# EAGLE design booz_imu (EAGLE 6.1)
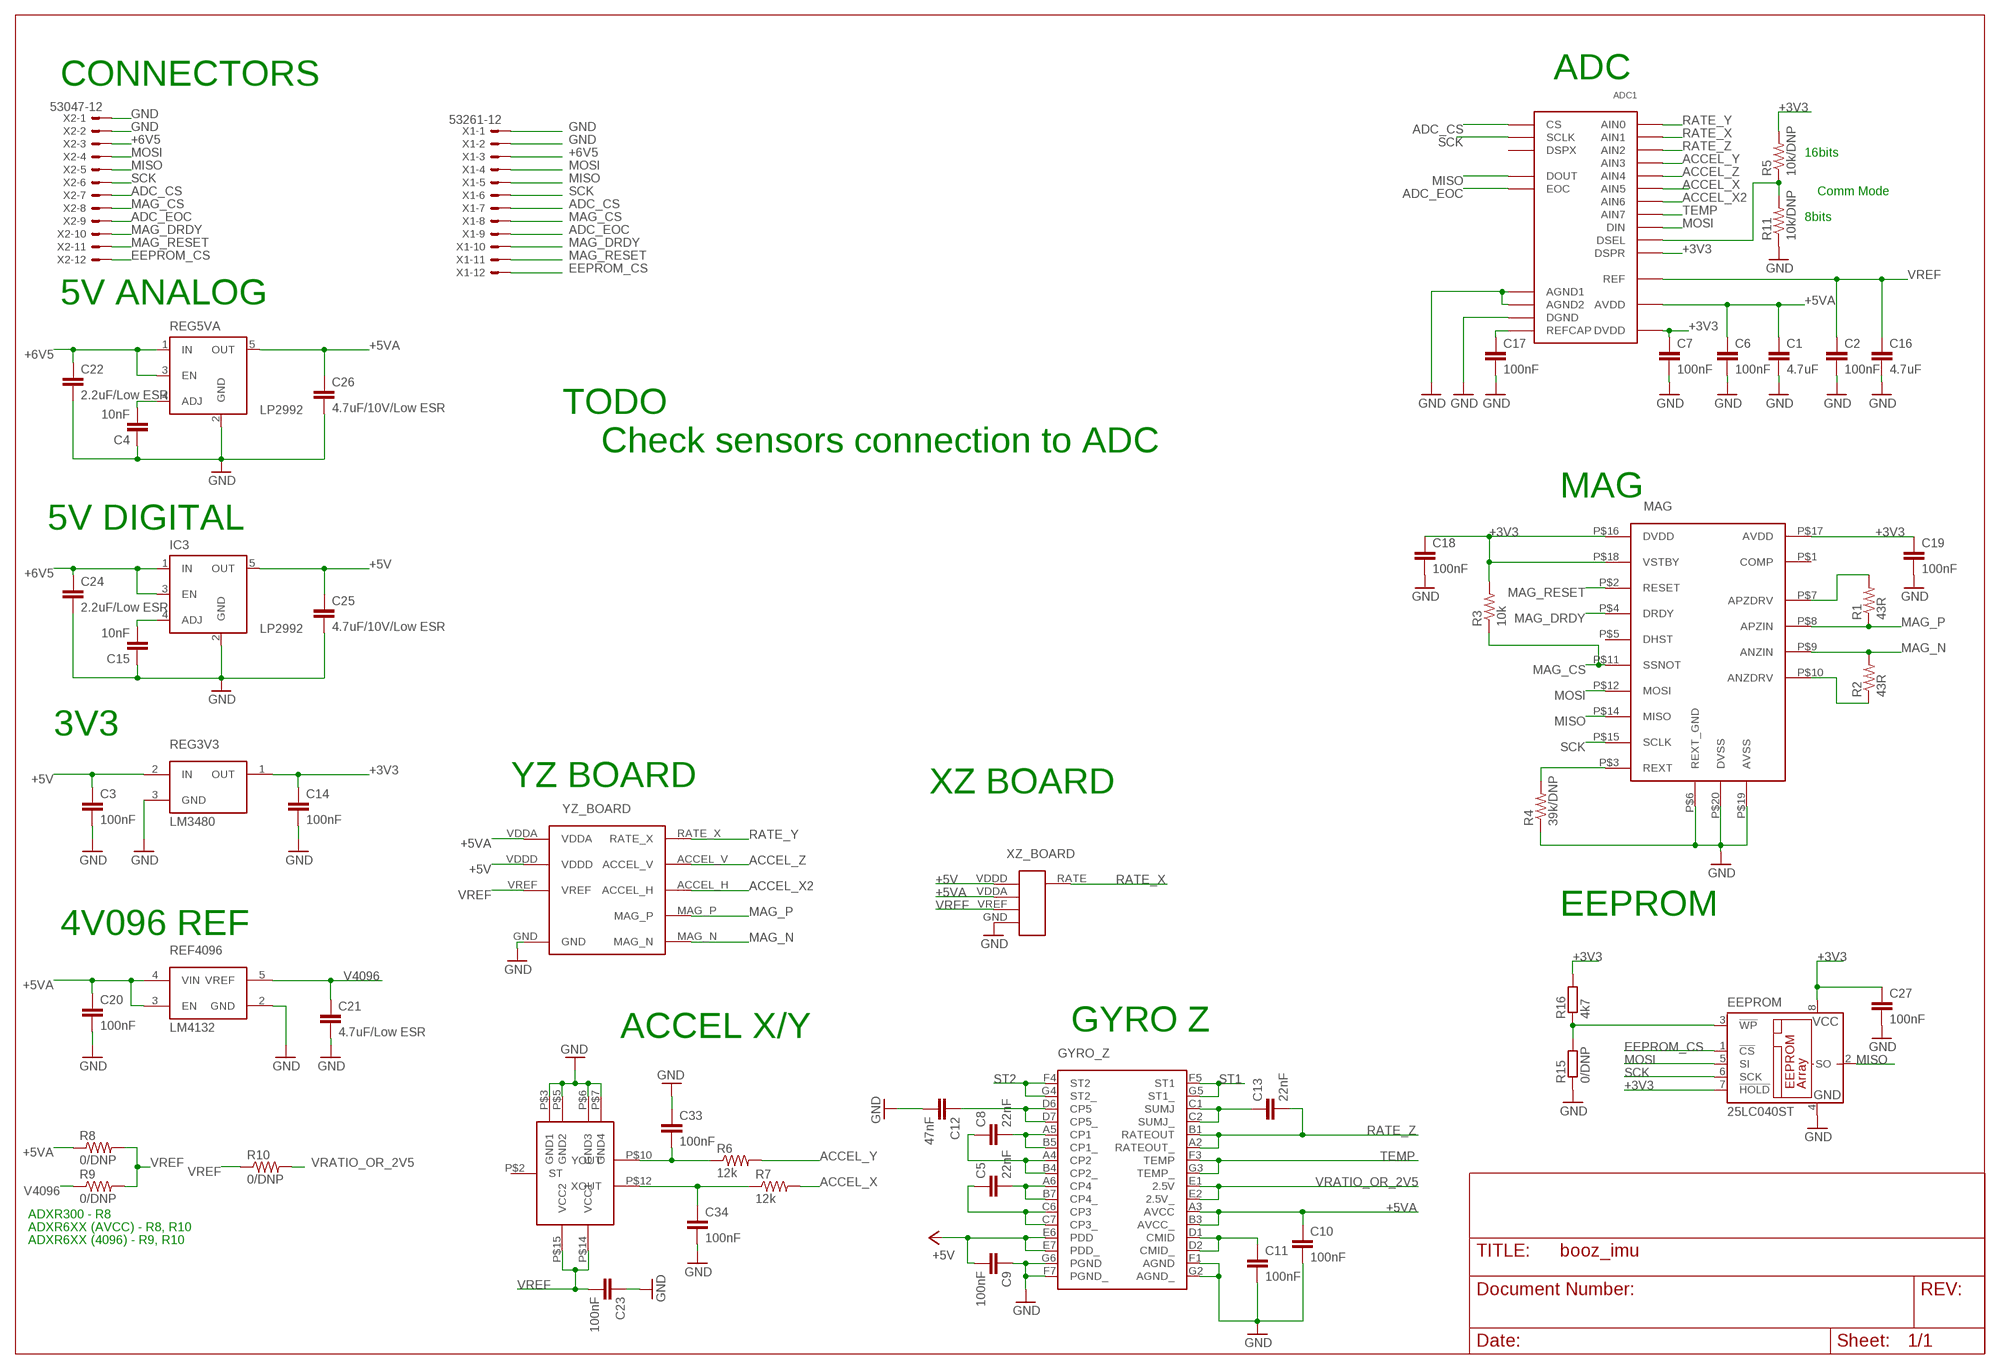
[diagram p0: schematic, sheet 1]

## Parts
ADC1  MAX1168  [QSOP24]
C1  4.7uF  C-EUC0805  [C0805]
C2  100nF  C-EUC0603K  [C0603K]
C3  100nF  C-EUC0603K  [C0603K]
C4  10nF  C-EUC0603K  [C0603K]
C5  22nF  C-EUC0603K  [C0603K]
C6  100nF  C-EUC0603K  [C0603K]
C7  100nF  C-EUC0603K  [C0603K]
C8  22nF  C-EUC0603K  [C0603K]
C9  100nF  C-EUC0603K  [C0603K]
C10  100nF  C-EUC0603K  [C0603K]
C11  100nF  C-EUC0603K  [C0603K]
C12  47nF  C-EUC0603K  [C0603K]
C13  22nF  C-EUC0603K  [C0603K]
C14  100nF  C-EUC0603K  [C0603K]
C15  10nF  C-EUC0603K  [C0603K]
C16  4.7uF  C-EUC0805  [C0805]
C17  100nF  C-EUC0603K  [C0603K]
C18  100nF  C-EUC0603K  [C0603K]
C19  100nF  C-EUC0603K  [C0603K]
C20  100nF  C-EUC0603K  [C0603K]
C21  4.7uF/Low ESR  C-EUC0805K  [C0805K]
C22  2.2uF/Low ESR  C-EUC0603K  [C0603K]
C23  100nF  C-EUC0603K  [C0603K]
C24  2.2uF/Low ESR  C-EUC0603K  [C0603K]
C25  4.7uF/10V/Low ESR  C-EUC0805K  [C0805K]
C26  4.7uF/10V/Low ESR  C-EUC0805K  [C0805K]
C27  100nF  C-EUC0603  [C0603]
C33  100nF  C-EUC0603K  [C0603K]
C34  100nF  C-EUC0603K  [C0603K]
EEPROM  25LC040ST  [TSSOP8]
GYRO_Z  ADXR  [BC-32]
IC3  LP2992  MIC5219BM5  [SOT23-5]
MAG  MS2100  [QFN20]
R1  43R  R-US_R0603  [R0603]
R2  43R  R-US_R0603  [R0603]
R3  10k  R-US_R0603  [R0603]
R4  39k/DNP  R-US_R0603  [R0603]
R5  10k/DNP  R-US_R0603  [R0603]
R6  12k  R-US_R0603  [R0603]
R7  12k  R-US_R0603  [R0603]
R8  0/DNP  R-US_R0603  [R0603]
R9  0/DNP  R-US_R0603  [R0603]
R10  0/DNP  R-US_R0603  [R0603]
R11  10k/DNP  R-US_R0603  [R0603]
R15  0/DNP  R-EU_R0603  [R0603]
R16  4k7  R-EU_R0603  [R0603]
REF4096  LM4132  [SOT23-5L]
REG3V3  LM3480  [SOT23]
REG5VA  LP2992  MIC5219BM5  [SOT23-5]
U$2  ADXL320  [LSCFP]
X1  53261-12  [53261-12]
X2  53047-12  [53047-12]
XZ_BOARD  IMU_XZ_2  [IMU_XZ]
YZ_BOARD  IMU_YZ_MAG_2  [IMU_YZ_MAG]

## Nets
+3V3: ADC1.P$1(DSPR) ADC1.P$22(DVDD) C7.1 C14.1 C18.1 C19.1 C27.1 EEPROM.7(!HOLD) EEPROM.8(VCC) MAG.P$16(DVDD) MAG.P$17(AVDD) MAG.P$18(VSTBY) R3.2 R5.2 R16.2 REG3V3.1(OUT)
+5V: C3.1 C9.2 C25.1 GYRO_Z.E6(PDD) GYRO_Z.E7(PDD_) IC3.5(OUT) REG3V3.2(IN) XZ_BOARD.VDDD YZ_BOARD.VDDD
+5VA: ADC1.P$19(AVDD) C1.1 C6.1 C10.1 C20.1 C26.1 GYRO_Z.A3(AVCC) GYRO_Z.B3(AVCC_) R8.1 REF4096.3(EN) REF4096.4(VIN) REG5VA.5(OUT) XZ_BOARD.VDDA YZ_BOARD.VDDA
+6V5: C22.1 C24.1 IC3.1(IN) IC3.3(EN) REG5VA.1(IN) REG5VA.3(EN) X1.3 X2.3
ACCEL_X: ADC1.P$12(AIN5) R7.2
ACCEL_X2: ADC1.P$13(AIN6) YZ_BOARD.ACCEL_H
ACCEL_Y: ADC1.P$10(AIN3) R6.2
ACCEL_Z: ADC1.P$11(AIN4) YZ_BOARD.ACCEL_V
ADC_CS: ADC1.P$20(CS) X1.7 X2.7
ADC_EOC: ADC1.P$6(EOC) X1.9 X2.9
EEPROM_CS: EEPROM.1(!CS) X1.12 X2.12
GND: ADC1.P$17(AGND1) ADC1.P$18(AGND2) ADC1.P$21(DGND) C1.2 C2.2 C3.2 C4.1 C6.2 C7.2 C9.1 C10.2 C11.2 C12.2 C14.2 C15.1 C16.2 C17.2 C18.2 C19.2 C20.2 C21.2 C22.2 C23.1 C24.2 C25.2 C26.2 C27.2 C33.1 C34.2 EEPROM.4(GND) GYRO_Z.F1(AGND) GYRO_Z.F7(PGND_) GYRO_Z.G2(AGND_) GYRO_Z.G6(PGND) IC3.2(GND) MAG.P$6(REXT_GND) MAG.P$19(AVSS) MAG.P$20(DVSS) R4.1 R11.1 R15.1 REF4096.2(GND) REG3V3.3(GND) REG5VA.2(GND) U$2.P$3(GND1) U$2.P$5(GND2) U$2.P$6(GND3) U$2.P$7(GND4) X1.1 X1.2 X2.1 X2.2 XZ_BOARD.GND YZ_BOARD.GND
MAG_CS: MAG.P$11(SSNOT) R3.1 X1.8 X2.8
MAG_DRDY: MAG.P$4(DRDY) X1.10 X2.10
MAG_N: MAG.P$9(ANZIN) R2.2 YZ_BOARD.MAG_N
MAG_P: MAG.P$8(APZIN) R1.1 YZ_BOARD.MAG_P
MAG_RESET: MAG.P$2(RESET) X1.11 X2.11
MISO: ADC1.P$3(DOUT) EEPROM.2(SO) MAG.P$14(MISO) X1.5 X2.5
MOSI: ADC1.P$5(DIN) EEPROM.5(SI) MAG.P$12(MOSI) X1.4 X2.4
N$1: ADC1.P$2(DSEL) R5.1 R11.2
N$3: ADC1.P$16(REFCAP) C17.1
N$7: C5.2 GYRO_Z.A6(CP4) GYRO_Z.B7(CP4_)
N$8: C5.1 GYRO_Z.C6(CP3) GYRO_Z.C7(CP3_)
N$9: C8.2 GYRO_Z.A5(CP1) GYRO_Z.B5(CP1_)
N$10: C8.1 GYRO_Z.A4(CP2) GYRO_Z.B4(CP2_)
N$11: C13.1 GYRO_Z.C1(SUMJ) GYRO_Z.C2(SUMJ_)
N$12: C12.1 GYRO_Z.D6(CP5) GYRO_Z.D7(CP5_)
N$13: C11.1 GYRO_Z.D1(CMID) GYRO_Z.D2(CMID_)
N$15: MAG.P$10(ANZDRV) R2.1
N$16: MAG.P$7(APZDRV) R1.2
N$18: MAG.P$3(REXT) R4.2
N$19: C15.2 IC3.4(ADJ)
N$20: C33.2 R6.1 U$2.P$10(YOUT)
N$23: C4.2 REG5VA.4(ADJ)
N$32: C34.1 R7.1 U$2.P$12(XOUT)
N$39: EEPROM.3(!WP) R15.2 R16.1
RATE_X: ADC1.P$8(AIN1) XZ_BOARD.RATE
RATE_Y: ADC1.P$7(AIN0) YZ_BOARD.RATE_X
RATE_Z: ADC1.P$9(AIN2) C13.2 GYRO_Z.A2(RATEOUT_) GYRO_Z.B1(RATEOUT)
SCK: ADC1.P$4(SCLK) EEPROM.6(SCK) MAG.P$15(SCLK) X1.6 X2.6
ST1: GYRO_Z.F5(ST1) GYRO_Z.G5(ST1_)
ST2: GYRO_Z.F4(ST2) GYRO_Z.G4(ST2_)
TEMP: ADC1.P$14(AIN7) GYRO_Z.F3(TEMP) GYRO_Z.G3(TEMP_)
V4096: C21.1 R9.1 REF4096.5(VREF)
VRATIO_OR_2V5: GYRO_Z.E1(2.5V) GYRO_Z.E2(2.5V_) R10.2
VREF: ADC1.P$15(REF) C2.1 C16.1 C23.2 R8.2 R9.2 R10.1 U$2.P$14(VCC1) U$2.P$15(VCC2) XZ_BOARD.VREF YZ_BOARD.VREF
Unconnected: ADC1.P$23(DSPX) MAG.P$1(COMP) MAG.P$5(DHST) U$2.P$2(ST)

## Notes on the sheet
- CONNECTORS | ADC
- 16bits
- Comm Mode
- 8bits
- 5V ANALOG
- TODO
- Check sensors connection to ADC
- MAG
- 5V DIGITAL
- 3V3
- YZ BOARD | XZ BOARD
- EEPROM
- 4V096 REF
- ACCEL X/Y | GYRO Z
- ADXR300 - R8
- ADXR6XX (AVCC) - R8, R10
- ADXR6XX (4096) - R9, R10

## Library data of the parts
ADC1 = booz:MAX1168
C1-C27 C33 C34 = rcl:C-EU: CAPACITOR, European symbol
EEPROM = microchip:25*: Serial EEPROM 4 K, SPI bus
GYRO_Z = paparazzi:ADXR
IC3 REG5VA = v-reg-micrel:MIC5219BM5: VOLTAGE REGULATOR
MAG = booz:MS2100
R1-R11 = rcl:R-US_: RESISTOR, American symbol
R15 R16 = rcl:R-EU_: RESISTOR, European symbol
REF4096 = booz:LM4132: Precision LDO Voltage Reference
REG3V3 = booz:LM3480
U$2 = paparazzi:ADXL320
X1 X2 = con-molex:53?-12: CONNECTOR wire to board 1.25 mm (.049 inch) pitch header
XZ_BOARD = booz:IMU_XZ_2
YZ_BOARD = booz:IMU_YZ_MAG_2

## Board
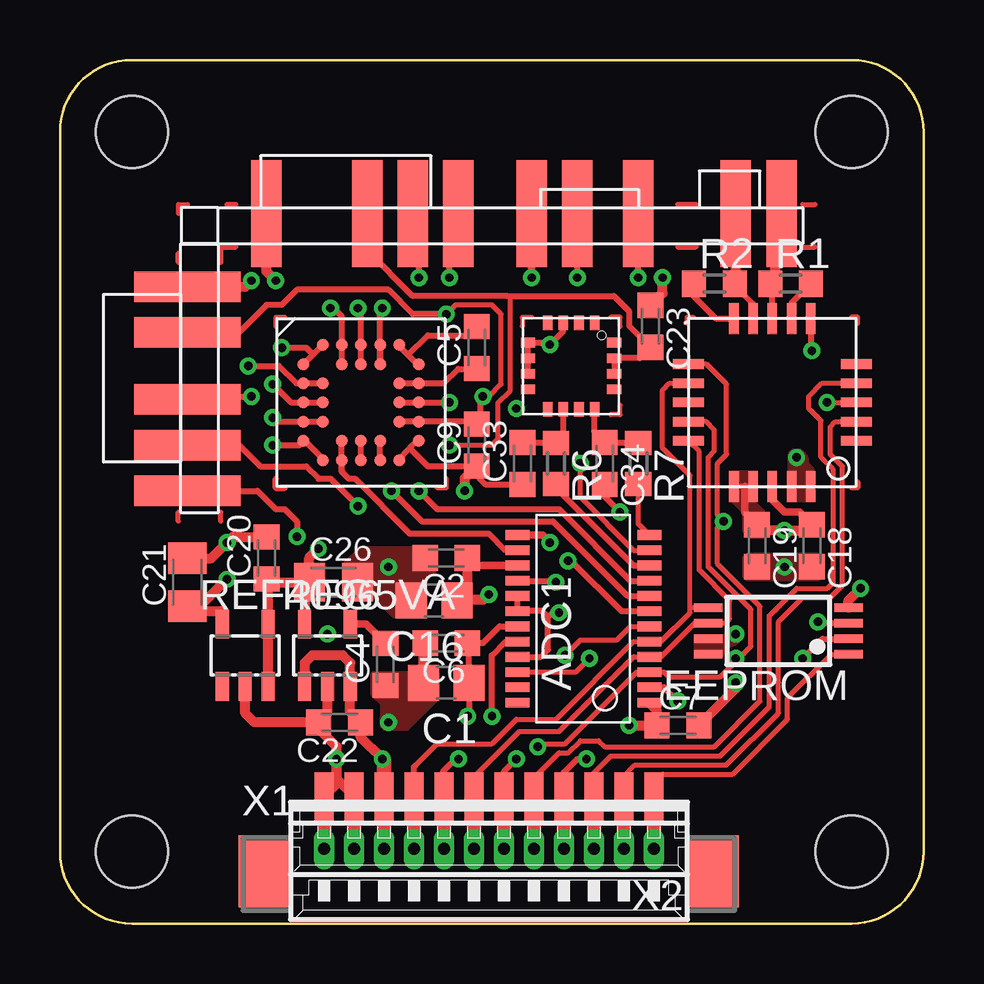
[diagram p1: board, top side]
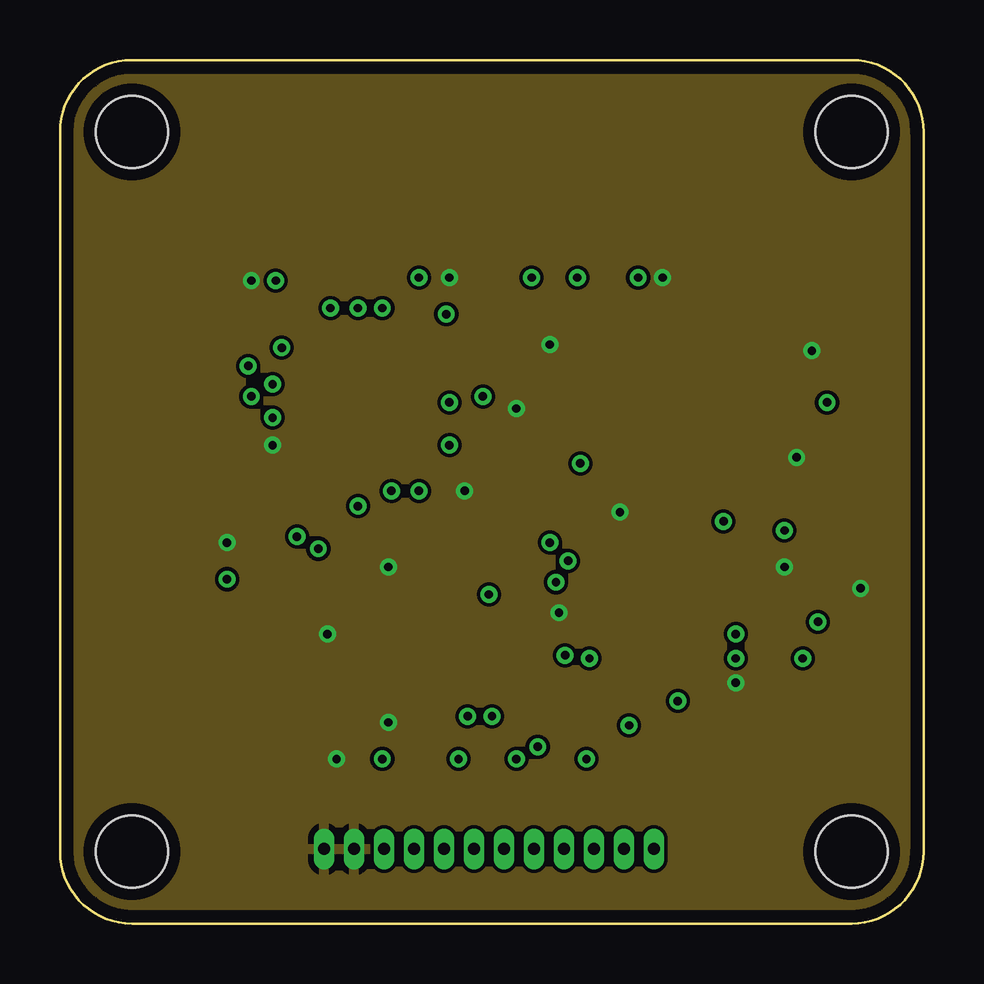
[diagram p2: board, inner layer Route2]
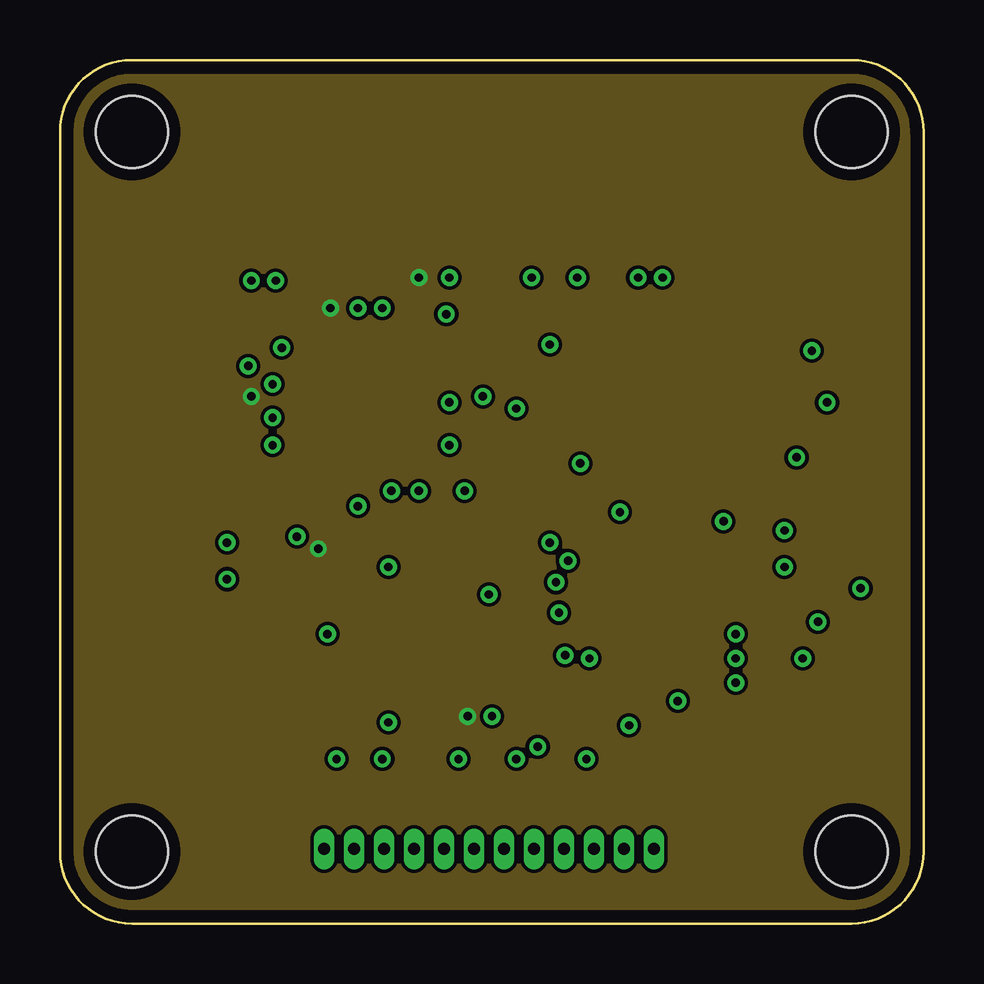
[diagram p3: board, inner layer Route15]
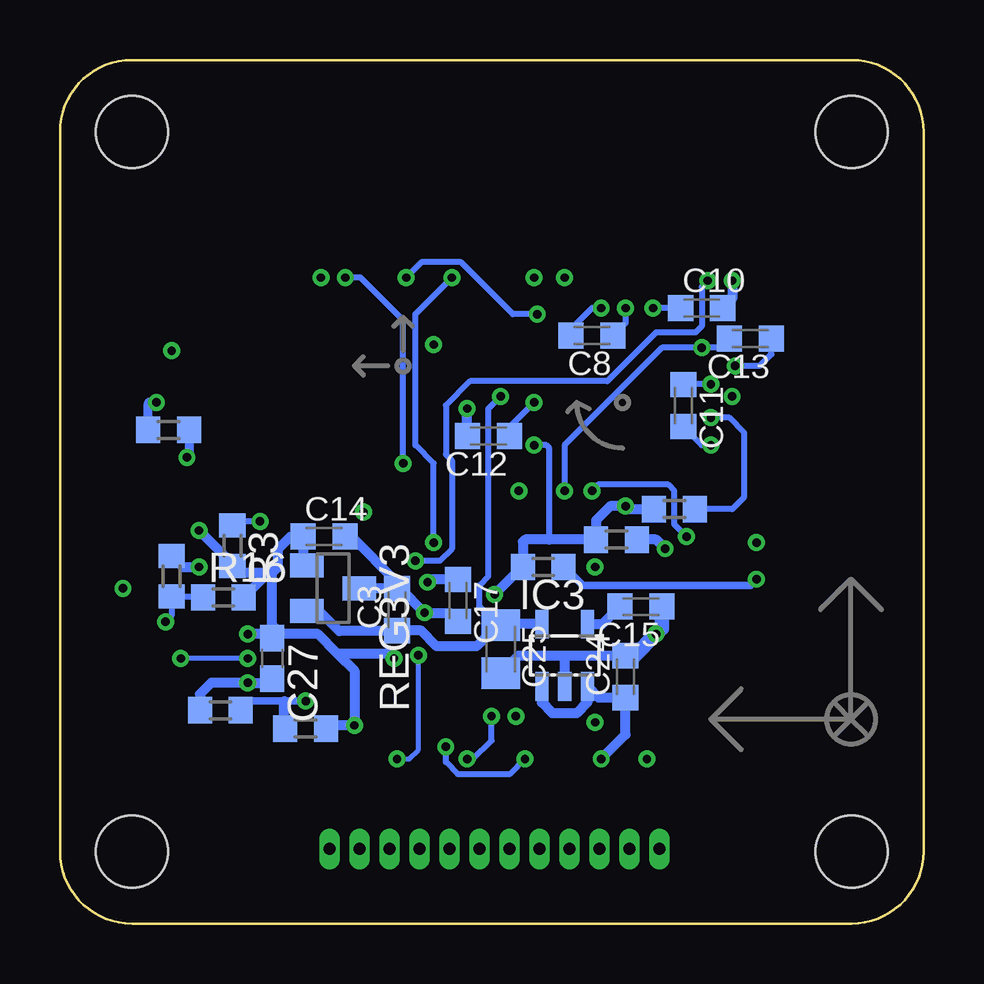
[diagram p4: board, bottom side, seen from below]

Size 36 x 36 mm. Coordinates in mm from the lower left corner, seen from the top.
Outline: 3,36 33,36 arc-90 36,33 36,3 arc-90 33,0 3,0 arc-90 0,3 0,33 arc-90 3,36
Copper layers (1*2+15*16): Top 0.035mm / dielectric 0.2mm / Route2 0.035mm / dielectric 1.5mm / Route15 0.035mm / dielectric 0.2mm / Bottom 0.035mm
Design rules: minimum track width 0.15mm, minimum drill 0.35mm, track to track 0.15mm, track to pad 0.15mm, pad to pad 0.15mm, via to via 0.15mm, smd to smd 0.15mm, copper to edge 20mil, drill to drill 8mil, minimum pad ring 0.177mm, minimum via ring 0.177mm, stop-mask expansion 4mil, vias tented up to drill 14mil, thermal gap 10mil
Holes 3 mm at 3,33 33,33 33,3 3,3
tKeepout: area 0,30 to 6,36; area 30,30 to 36,36; area 0,0 to 6,6; area 30,0 to 36,6

### Footprints (pad centres in the part's own frame; a part is rotated, then mirrored left to right if it is on the bottom)
QSOP24 = smd 0.4 x 1: P$1 -3.493,-2.75; P$2 -2.857,-2.75; P$3 -2.223,-2.75; P$4 -1.587,-2.75; P$5 -0.953,-2.75; P$6 -0.318,-2.75; P$7 0.318,-2.75; P$8 0.953,-2.75; P$9 1.587,-2.75; P$10 2.223,-2.75; P$11 2.857,-2.75; P$12 3.493,-2.75; P$13 3.493,2.75; P$14 2.857,2.75; P$15 2.223,2.75; P$16 1.587,2.75; P$17 0.953,2.75; P$18 0.318,2.75; P$19 -0.318,2.75; P$20 -0.953,2.75; P$21 -1.587,2.75; P$22 -2.223,2.75; P$23 -2.857,2.75; P$24 -3.493,2.75
C0805 = smd 1.3 x 1.5: 1 -0.95,0; 2 0.95,0
C0603K = smd 1.05 x 1.08: 1 -0.875,0; 2 0.875,0
C0805K = smd 1.3 x 1.6: 1 -1,0; 2 1,0
C0603 = smd 1.1 x 1: 1 -0.85,0; 2 0.85,0
TSSOP8 = smd 0.35 x 1.2: 1 -0.975,-2.925; 2 -0.325,-2.925; 3 0.325,-2.925; 4 0.975,-2.925; 5 0.975,2.925; 6 0.325,2.925; 7 -0.325,2.925; 8 -0.975,2.925
BC-32 = smd 0.5 x 0.5: A2 -1.6,2.4; A3 -0.8,2.4; A4 0,2.4; A5 0.8,2.4; A6 1.6,2.4; B1 -2.4,1.6; B3 -0.8,1.6; B4 0,1.6; B5 0.8,1.6; B7 2.4,1.6; C1 -2.4,0.8; C2 -1.6,0.8; C6 1.6,0.8; C7 2.4,0.8; D1 -2.4,0; D2 -1.6,0; D6 1.6,0; D7 2.4,0; E1 -2.4,-0.8; E2 -1.6,-0.8; E6 1.6,-0.8; E7 2.4,-0.8; F1 -2.4,-1.6; F3 -0.8,-1.6; F4 0,-1.6; F5 0.8,-1.6; F7 2.4,-1.6; G2 -1.6,-2.4; G3 -0.8,-2.4; G4 0,-2.4; G5 0.8,-2.4; G6 1.6,-2.4
SOT23-5 = smd 0.55 x 1.2: 1 -0.95,-1.3; 2 0,-1.3; 3 0.95,-1.3; 4 0.95,1.3; 5 -0.95,1.3
QFN20 = smd 1.3 x 0.4: P$1 -3.5,1.6; P$2 -3.5,0.8; P$3 -3.5,0; P$4 -3.5,-0.8; P$5 -3.5,-1.6; P$11 3.5,-1.6; P$12 3.5,-0.8; P$13 3.5,0; P$14 3.5,0.8; P$15 3.5,1.6 | smd 0.4 x 1.3: P$6 -1.6,-3.5; P$7 -0.8,-3.5; P$8 0,-3.5; P$9 0.8,-3.5; P$10 1.6,-3.5; P$16 1.6,3.5; P$17 0.8,3.5; P$18 0,3.5; P$19 -0.8,3.5; P$20 -1.6,3.5
R0603 = smd 1 x 1.1: 1 -0.85,0; 2 0.85,0
SOT23-5L = smd 0.55 x 1.2: 1 -0.95,-1.3; 2 0,-1.3; 3 0.95,-1.3; 4 0.95,1.3; 5 -0.95,1.3
SOT23 = smd 1 x 1.4: 1 -0.95,-1.1; 2 0.95,-1.1; 3 0,1.1
LSCFP = smd 0.6 x 0.4: P$1 -1.8,0.975; P$2 -1.8,0.325; P$3 -1.8,-0.325; P$4 -1.8,-0.975; P$9 1.8,-0.975; P$10 1.8,-0.325; P$11 1.8,0.325; P$12 1.8,0.975 | smd 0.4 x 0.6: P$5 -0.975,-1.8; P$6 -0.325,-1.8; P$7 0.325,-1.8; P$8 0.975,-1.8; P$13 0.975,1.8; P$14 0.325,1.8; P$15 -0.325,1.8; P$16 -0.975,1.8
53261-12 = smd 0.8 x 2: 1 6.875,-2.5; 2 5.625,-2.5; 3 4.375,-2.5; 4 3.125,-2.5; 5 1.875,-2.5; 6 0.625,-2.5; 7 -0.625,-2.5; 8 -1.875,-2.5; 9 -3.125,-2.5; 10 -4.375,-2.5; 11 -5.625,-2.5; 12 -6.875,-2.5 | smd 2.1 x 3: S1 9.375,0.625; S2 -9.375,0.625
53047-12 = drill 0.5 pad 0.698 long: 1 6.875,0.45; 2 5.625,0.45; 3 4.375,0.45; 4 3.125,0.45; 5 1.875,0.45; 6 0.625,0.45; 7 -0.625,0.45; 8 -1.875,0.45; 9 -3.125,0.45; 10 -4.375,0.45; 11 -5.625,0.45; 12 -6.875,0.45
IMU_XZ = smd 1.27 x 4.445: GND 3.81,0.508; RATE -4.699,0.508; VDDA -0.889,0.508; VDDD 1.905,0.508; VREF -2.794,0.508
IMU_YZ_MAG = smd 1.27 x 4.445: ACCEL_H 3.81,0.508; ACCEL_V 8.255,0.508; GND 0.762,0.508; MAG_N 12.319,0.508; MAG_P 14.224,0.508; RATE_X -7.239,0.508; VDDA -1.143,0.508; VDDD 5.715,0.508; VREF -3.048,0.508

### Placement (x,y rotation side)
ADC1  21.82,12.7 90 top
C1  16.11,10.04 180 top
C2  16.11,15.24 180 top
C3  21.95,13.09 90 bottom
C4  13.56,10.8 90 top
C5  17.38,24.01 90 top
C6  16.11,11.69 180 top
C7  25.76,8.26 0 top
C8  13.82,24.52 180 bottom
C9  17.38,19.94 90 top
C10  9.25,25.66 0 bottom
C11  10.01,21.59 270 bottom
C12  18.14,20.32 180 bottom
C13  7.22,24.39 180 bottom
C14  25,16.13 0 bottom
C15  11.79,13.21 180 bottom
C16  15.6,13.47 180 top
C17  19.41,13.47 270 bottom
C18  31.34,15.75 270 top
C19  29.06,15.75 270 top
C20  8.61,15.24 90 top
C21  5.31,14.23 90 top
C22  11.66,8.39 180 top
C23  24.61,24.9 270 top
C24  12.42,10.29 90 bottom
C25  17.63,11.43 270 bottom
C26  11.41,14.23 0 top
C27  27.15,11.05 270 bottom
C33  19.28,19.18 90 top
C34  22.71,19.18 270 top
EEPROM  29.95,12.2 90 top
GYRO_Z  12.55,21.72 0 top
IC3  14.96,11.18 0 bottom
MAG  29.69,21.72 180 top
R1  30.46,26.67 0 top
R2  27.28,26.67 0 top
R3  28.81,15.75 270 bottom
R4  31.47,20.58 180 bottom
R5  25.76,8.13 0 bottom
R6  20.68,19.18 270 top
R7  24.11,19.18 270 top
R8  12.8,16.01 180 bottom
R9  15.85,14.86 180 bottom
R10  10.39,17.28 0 bottom
R11  29.31,8.89 0 bottom
R15  31.34,14.48 270 bottom
R16  29.19,13.59 0 bottom
REF4096  7.72,11.18 0 top
REG3V3  24.61,13.97 270 bottom
REG5VA  11.15,11.18 0 top
U$2  21.31,23.24 270 top
X1  17.88,2.8 180 top
X2  17.88,3.56 180 top
XZ_BOARD  5.82,22.74 90 top
YZ_BOARD  15.85,29.09 0 top

### Tracks (layer width: path | path; a pad name or v marks a point on that pad's centre or on a via)
+3V3  (via drill 0.35)
  Top 0.203: MAG.P$16 28.55,18.22 MAG.P$17 | ADC1.P$22 21.5,10.48 v22.07,11.05
  Top 0.305: MAG.P$18 29.69,17.66 30.2,17.15 30.82,17.15 C18.1 | 28.55,18.22 28.55,17.13 C19.1
  Top 0.406: ADC1.P$1 24.55,9.21 24.88,8.88 C7.1 v23.72,8.26 | C18.1 31.11,16.39 v30.2,16.39 29.3,16.39 C19.1
  Bottom 0.254: R5.2 24.61,8.13
  Bottom 0.406: C14.1 26.39,16.13 26.9,15.62 26.9,14.86 27.15,14.61 | C14.1 25.71,15.98 | 27.15,14.61 27.28,14.61 | REG3V3.1 25.87,15.08 C14.1 | v30.2,16.39 28.81,14.99 R3.2 28.51,14.61 27.28,14.61 | R16.2 27.32,14.61 27.28,14.61 | 27.15,12.45 C27.1 27.32,12.07 v28.17,12.07 | 27.15,12.45 27.15,14.61 | 27.15,12.45 26.77,12.07 25.25,12.07 24.42,11.24 | 24.42,11.24 23.72,10.55 v23.72,8.26 24.78,8.26 R5.2 | v22.07,11.05 22.26,11.24 24.42,11.24
  pour Top (no thermals): 26.52,11.94 26.52,11.18 27.53,11.18 28.42,11.94 28.42,12.2 28.17,12.32 27.66,11.94
  pour Top (no thermals): 28.04,18.8 28.93,18.8 28.93,17.66 28.93,17.53 29.31,17.15 29.31,16.13 28.81,16.13 28.55,16.39 28.55,17.15 28.04,17.66
+5V  (via drill 0.35)
  Top 0.203: v17.63,21.98 17.88,21.98 18.39,22.48 18.39,25.4 18.01,25.78 16.49,25.78 v16.11,25.4
  Top 0.254: 17.38,20.58 C9.2 17.38,20.7 | 17.38,20.7 17.38,20.83 17.29,20.92 GYRO_Z.E7 GYRO_Z.E6 | v21.57,26.93 YZ_BOARD.VDDD | 17.38,20.7 17.5,20.7 17.5,21.85 v17.63,21.98 | v16.11,25.4 14.71,25.4 13.69,26.42 9.88,26.42 9.25,25.78 8.61,25.78 7.47,24.64 XZ_BOARD.VDDD
  Bottom 0.254: v16.11,25.4 17.12,25.4 19.28,27.56 20.93,27.56 v21.57,26.93 | v17.63,21.98 18.14,21.47 18.14,14.48 18.52,14.1 18.52,13.21 17.74,12.43
  Bottom 0.406: IC3.5 17.58,12.48 C25.1 17.74,12.43 17.77,12.43 18.64,11.56 20.3,11.56 20.94,12.21 C3.1 22.44,12.21 22.45,12.2 24.36,12.2 25.19,13.02 REG3V3.2
+5VA  (via drill 0.35)
  Top 0.254: GYRO_Z.A3 GYRO_Z.B3 11.75,23.33 11.79,23.37 11.75,23.41 GYRO_Z.A3 | GYRO_Z.A3 11.75,25.31 11.41,25.66 v11.28,25.66 | v14.96,26.93 14.96,28.83 | 5.94,21.98 v7.98,21.98 | ADC1.P$19 18.33,12.39 17.63,11.69 C6.1 17.06,11.61 C1.1 17.06,8.7 v16.99,8.64
  Top 0.406: 8.67,14.31 C20.1 | 8.67,14.31 REF4096.4 REF4096.3 | 8.67,14.31 8.75,14.23 C26.1 | REG5VA.5 10.2,14.02 C26.1 | v10.77,15.62 10.39,15.24 10.39,14.24 C26.1 | 14.96,28.83 14.96,29.34 YZ_BOARD.VDDA | XZ_BOARD.VDDA 5.82,21.85 5.94,21.98
  Bottom 0.254: C10.1 v11.28,25.66
  Bottom 0.406: R8.1 11.15,16.01 v10.77,15.62
  pour Route15: 0.48,35.44 35.54,35.44 35.54,0.51 0.48,0.51
+6V5  (via drill 0.35)
  Top 0.406: REG5VA.1 10.2,10.87 10.52,11.18 11.79,11.18 12.1,10.87 REG5VA.3 12.1,8.82 C22.1 12.53,7.77 v13.44,6.86
  Top 0.61: v13.44,6.86 13.51,6.79 X1.3 X2.3
  Bottom 0.406: C24.1 12.42,9.31 | v13.44,6.86 12.42,7.88 C24.1 | IC3.1 15.91,9.21 15.47,8.77 14.45,8.77 14.01,9.21 IC3.3 13.55,9.42 C24.1
ACCEL_X
  Top 0.203: ADC1.P$12 24.11,16.66 R7.2
ACCEL_X2  (via drill 0.35)
  Top 0.305: v19.66,26.93 YZ_BOARD.ACCEL_H | ADC1.P$13 20.11,16.2 v20.42,15.88
  Bottom 0.254: v19.66,26.93 21.19,25.4 21.19,19.94 20.42,19.18 v20.42,15.88
ACCEL_Y
  Top 0.254: R6.2 20.68,18.16 20.93,17.91 23.92,14.93 ADC1.P$10
ACCEL_Z  (via drill 0.35)
  Top 0.203: ADC1.P$11 23.92,15.56 21.69,17.78 v21.69,19.18
  Top 0.254: v24.11,26.93 YZ_BOARD.ACCEL_V
  Bottom 0.254: v24.11,26.93 23.47,26.93 21.69,25.15 v21.69,19.18
ADC_CS  (via drill 0.35)
  Top 0.254: v19.03,6.86 18.52,6.35 X1.7 | ADC1.P$20 18.58,11.75 18.01,11.18 v18.01,8.64 18.01,8.51
  Top 0.61: X2.7 X1.7
  Bottom 0.254: v18.01,8.64 18.01,7.62 18.77,6.86 v19.03,6.86
ADC_EOC  (via drill 0.35)
  Top 0.203: v21.06,11.18 21.69,11.81 23.22,11.81 23.79,12.39 ADC1.P$6 | 21.01,3.18 21.01,5.8
  Top 0.254: 21.01,5.8 21.01,6.3 21.57,6.86 v21.95,6.86
  Top 0.61: 21.01,3 X2.9 21.01,3.18 X1.9
  Bottom 0.203: v21.95,6.86 21.44,6.86 21.06,7.24 v21.06,11.18
EEPROM_CS
  Top 0.203: 24.87,5.97 25.12,6.23 28.04,6.23 30.33,8.51 30.33,9.4 32.15,11.22 EEPROM.1
  Top 0.406: 24.87,5.97 24.87,5.41 X1.12
  Top 0.61: X2.12 X1.12
GND  (via drill 0.35)
  Top 0.203: 20.51,24.22 v20.42,24.13
  Top 0.254: 14.09,19.32 14.07,19.31 | GYRO_Z.G6 14.09,19.32 | 14.09,19.32 14.58,19.82 | C34.2 22.71,17.78 v23.34,17.15 | 10.15,20.18 10.14,20.2 | 10.15,20.18 GYRO_Z.F1 9.97,19.94 v8.87,19.94 | GYRO_Z.G2 10.95,19.38 10.15,20.18 | v16.23,26.93 16.23,28.71 | 14.58,19.82 14.89,20.12 GYRO_Z.F7 | C20.2 8.6,16.12 | ADC1.P$17 ADC1.P$18 20.1,13.02 20.34,12.78 | ADC1.P$21 20.04,11.12 20.34,11.42 20.34,12.78 | U$2.P$7 U$2.P$6 U$2.P$5 20.51,24.22 20.99,24.7 U$2.P$3 | C33.1 17.74,18.31 17.23,18.81 17.23,18.93 C9.1 15.33,19.07 14.58,19.82 | 20.34,12.78 20.52,12.96 v20.8,12.96 | MAG.P$6 31.29,23.93 v31.34,23.88
  Top 0.406: 7.72,9.78 REF4096.2 7.72,8.77 8.1,8.39 C22.2 | v11.53,6.86 11.53,7.37 10.78,8.12 C22.2 | XZ_BOARD.GND 7.72,26.55 v7.98,26.8 | C21.2 6.31,15.23 v6.96,15.88 7.2,16.12 C20.2 | v11.53,6.86 11.53,5.82 X1.1 | X1.2 11.53,6.02 v11.53,6.86 | REG5VA.2 11.15,8.75 C22.2 | C6.2 15.16,11.61 C1.2 | C4.1 13.68,9.92 | C23.1 25.12,26.28 v25.12,26.93 | v33.38,13.97 32.87,13.47 EEPROM.4 | C7.2 28.17,9.8 v28.17,10.04 | v16.87,18.04 16.87,18.56 C9.1 | 16.23,28.71 16.61,29.09 YZ_BOARD.GND
  Top 0.61: X2.1 11.03,3.13 11.03,5.21 | X2.2 X1.2 12.3,5.34
  Bottom 0.254: C11.2 10.01,20.7 9.25,19.94 v8.87,19.94
  Bottom 0.381: v30.71,19.44 30.62,19.52 R4.1
  Bottom 0.406: R11.1 30.16,9.57 29.69,10.04 v28.17,10.04 27.32,10.04 C27.2 | C10.2 7.98,26.05 v7.98,26.8 | C3.2 21.95,14.23 23.85,16.13 C14.2 | C3.2 21.83,13.85 | v19.03,21.47 19.03,20.34 C12.2 | C17.2 19.77,12.96 v20.8,12.96 21.81,13.96 C3.2 | C25.2 16.9,11.17 14.96,11.17 | C24.2 14.96,11.17 | 14.96,10.29 IC3.2 14.96,11.17 | REG3V3.3 C3.2 | R15.1 30.88,14.86 v30.2,14.86
  Bottom 0.61: 12.41,11.18 C24.2 12.06,11.17 v11.15,12.07 10.91,12.31 C15.1
  other vias: 13.69,14.86 13.69,8.39
  pour Route2: 0.36,35.44 35.41,35.44 35.41,0.38 0.36,0.38
  pour Top (no thermals): 13.56,8.13 13.44,8.26 13.44,9.15 13.06,9.53 13.06,10.42 15.72,10.42 15.72,9.4 14.45,8.13
  pour Top (no thermals): 15.6,15.62 12.55,15.62 11.91,14.99 11.91,13.72 12.04,13.59 13.18,13.59 13.95,12.83 15.22,12.83 15.22,14.35 15.6,14.74
  pour Top (no thermals): 28.68,15.37 31.6,15.37 31.73,15.24 31.73,14.48 31.6,14.35 28.68,14.35 28.55,14.48 28.55,15.24
  pour Top (no thermals): 30.46,17.78 30.46,19.56 30.58,19.69 30.84,19.69 31.09,19.44 31.09,19.18 31.34,18.93 31.34,17.78 31.22,17.66 30.58,17.66
MAG_CS  (via drill 0.35)
  Top 0.203: 19.76,5.44 19.76,6.07 20.8,7.12 21.19,7.12 21.69,7.62 22.45,7.62 22.71,7.37 27.28,7.37 29.19,9.27 29.19,9.91 29.19,13.21 27.41,14.99 27.41,16.51 v27.66,16.77 27.41,17.02 27.41,19.18 27.79,19.56 27.79,22.48 26.95,23.32 MAG.P$11
  Top 0.61: X2.8 X1.8 19.76,5.44
  Bottom 0.254: v27.66,16.77 28.64,16.77 R3.1
MAG_DRDY
  Top 0.203: MAG.P$4 31.76,22.52 31.22,21.98 31.22,21.47 31.73,20.96 31.73,19.44 32.23,18.93 32.23,14.23 31.98,13.97 30.71,13.97 29.57,12.83 29.57,9.66 29.57,9.02 27.53,6.99 22.96,6.99 22.26,6.28 22.26,3.36
  Top 0.61: X1.10 22.26,3.36 X2.10
MAG_N
  Top 0.254: MAG.P$9 28.89,25.82 28.04,26.67 R2.2
  Top 0.406: R2.2 28.17,26.71 YZ_BOARD.MAG_N 28.26,29.51 28.26,29
MAG_P
  Top 0.254: MAG.P$8 29.69,26.59 R1.1
  Top 0.406: R1.1 29.82,26.89 29.82,28.83 29.99,29 29.99,29.51 YZ_BOARD.MAG_P
MAG_RESET
  Top 0.203: MAG.P$2 32.32,20.92 32.11,20.7 32.11,19.56 32.61,19.05 32.61,14.1 32.11,13.59 30.96,13.59 29.95,12.58 29.95,10.04 29.95,8.77 27.79,6.61 23.98,6.61 23.51,6.14 23.51,5.38
  Top 0.254: 23.51,3.6 23.51,5.38
  Top 0.61: X1.11 23.51,3.6 X2.11
MISO  (via drill 0.35)
  Top 0.203: MAG.P$14 26.94,20.92 27.28,20.58 27.28,19.69 27.03,19.44 27.03,14.86 28.81,13.09 28.81,11.56 28.3,11.05 v28.17,11.05 28.17,10.93 27.53,10.29 25.38,10.29 25.19,10.48 ADC1.P$3 24.04,10.48 21.06,7.5 20.04,7.5 v19.92,7.37
  Top 0.254: X1.5 arc-90 15.98,4.69 15.98,6.35 16.49,6.86 v16.61,6.86 | EEPROM.2 31.78,11.87 v30.96,11.05
  Top 0.61: X2.5 16.01,4.66 15.98,4.69
  Bottom 0.203: v28.17,11.05 v30.96,11.05
  Bottom 0.254: v16.61,6.86 17.25,6.23 19.41,6.23 19.92,6.73 v19.92,7.37
MOSI
  Top 0.203: MAG.P$12 25.41,22.52 25.12,22.23 25.12,19.82 26.27,18.67 26.27,13.17 | 14.83,6.61 15.72,7.5 18.01,7.5 19.03,8.51 20.68,8.51 23.92,11.75 ADC1.P$5 25.06,11.75 26.27,12.96 26.27,13.17 | 26.27,13.17 EEPROM.5
  Top 0.254: 14.83,6.61 14.76,6.53 X1.4
  Top 0.61: X2.4 X1.4
N$1  (via drill 0.35)
  Top 0.254: ADC1.P$2 25.19,9.85 v25.76,9.27
  Bottom 0.305: v25.76,9.27 26.65,9.27 28.08,9.27 R11.2
  Bottom 0.406: R5.1 26.65,8.17 26.65,9.27
N$2
  Top 0.203: 26.52,29.98 25.76,29.98
N$3  (via drill 0.35)
  Top 0.254: ADC1.P$16 20.61,14.29 v20.68,14.23
  Bottom 0.406: C17.1 19.42,14.35 20.55,14.35 v20.68,14.23
N$4
  Top 0.203: 25.76,28.2 26.52,28.2
N$5
  Top 0.203: 7.34,29.98 6.96,29.98
N$6
  Top 0.203: 30.96,29.98 31.47,29.98
N$7
  Top 0.254: 14.09,24.12 14.07,24.13 | 14.09,24.12 GYRO_Z.A6 | GYRO_Z.B7 14.89,23.32 14.52,23.69 | 14.52,23.69 14.09,24.12 | 14.52,23.69 15.34,24.52 17.01,24.52 C5.2
N$8
  Top 0.254: GYRO_Z.C6 14.11,22.52 | 14.11,22.52 GYRO_Z.C7 16.02,22.52 16.61,23.12 17.38,23.12 C5.1 | 14.11,22.52 14.07,22.48
N$9  (via drill 0.35)
  Top 0.254: GYRO_Z.A5 GYRO_Z.B5 13.35,23.28 | GYRO_Z.A5 13.35,25.57 v13.44,25.66 | GYRO_Z.A5 13.35,23.28 | 13.35,23.28 13.31,23.24
  Bottom 0.254: v13.44,25.66 13.82,25.66 14.69,24.78 C8.2
N$10  (via drill 0.35)
  Top 0.254: GYRO_Z.A4 12.55,24.13 | GYRO_Z.B4 GYRO_Z.A4 | GYRO_Z.A4 12.55,25.53 v12.42,25.66
  Bottom 0.254: C8.1 12.42,25.04 v12.42,25.66
N$11  (via drill 0.35)
  Top 0.254: GYRO_Z.C2 GYRO_Z.C1 9.84,22.52 9.12,23.24 v7.85,23.24
  Bottom 0.254: v7.85,23.24 6.83,23.24 6.34,23.74 C13.1
N$12  (via drill 0.35)
  Top 0.254: GYRO_Z.D6 GYRO_Z.D7 | GYRO_Z.D7 v16.23,21.72 | GYRO_Z.D6 14.07,21.72 | GYRO_Z.D6 GYRO_Z.D7
  Bottom 0.254: 17.25,20.32 C12.1 17.26,20.69 v16.23,21.72
N$13  (via drill 0.35)
  Top 0.254: GYRO_Z.D1 10.14,21.72 | GYRO_Z.D1 GYRO_Z.D2 | v8.87,22.48 9.63,21.72 GYRO_Z.D1
  Bottom 0.254: v8.87,22.48 10.02,22.48 C11.1
N$14
  Top 0.203: 4.93,29.59 4.93,29.98 5.31,29.98
N$15
  Top 0.254: MAG.P$10 27.34,25.22 26.43,26.13 R2.1
N$16
  Top 0.254: MAG.P$7 30.49,25.86 R1.2
N$17
  Top 0.203: 6.71,27.56 6.71,28.2 7.34,28.2
N$18  (via drill 0.35)
  Top 0.203: v31.98,21.72 MAG.P$3
  Bottom 0.381: v31.98,21.72 32.28,21.72 32.32,21.68 R4.2
N$19
  Bottom 0.406: C15.2 13.39,12.48 IC3.4
N$20
  Top 0.254: U$2.P$10 20.99,20.03 R6.1 19.31,20.03 C33.2
N$21
  Top 0.203: 4.93,27.56 4.93,27.94
N$22
  Top 0.203: 4.93,16.77 4.93,17.15
N$23
  Top 0.254: C4.2 13.56,11.69
  Top 0.305: REG5VA.4 12.76,12.48 C4.2
N$24
  Top 0.203: 6.71,16.77 6.71,17.15
N$25
  Top 0.203: 30.96,28.2 31.47,28.2
N$26
  Top 0.203: 26.39,25.28 26.14,25.28 26.14,25.02
N$27
  Top 0.203: 33,18.16 33.25,18.16 33.25,18.42
N$28
  Top 0.203: 33,25.28 33.25,25.28 33.25,25.02
N$29
  Top 0.203: 22.96,21.21 23.34,21.21 23.34,21.59
N$30
  Top 0.203: 22.96,25.28 23.34,25.28 23.34,24.9
N$31
  Top 0.203: 19.66,25.28 19.28,25.28 19.28,24.9
N$32
  Top 0.254: U$2.P$12 22.29,20.48 C34.1 22.73,20.03 R7.1
N$33
  Top 0.203: 8.99,24.9 8.99,25.28 9.37,25.28
N$34
  Top 0.254: 8.99,18.55 8.99,18.16 9.37,18.16
N$35
  Top 0.203: 16.11,18.55 16.11,18.16 15.72,18.16
N$39  (via drill 0.35)
  Top 0.254: EEPROM.3 31.66,12.52 v31.6,12.58
  Bottom 0.254: R16.1 30.08,13.63 R15.2 31.34,12.83 v31.6,12.58
RATE_X  (via drill 0.35)
  Top 0.254: ADC1.P$8 23.66,13.66 20.55,16.77 15.09,16.77 v13.82,18.04 | XZ_BOARD.RATE 8.23,18.04 8.99,17.28 9.37,17.28 9.88,16.77 v9.88,16.13
  Bottom 0.254: v13.82,18.04 13.56,18.29 10.64,18.29 10.39,18.04 10.39,16.64 v9.88,16.13
RATE_Y  (via drill 0.35)
  Top 0.254: ADC1.P$7 23.41,13.02 21.31,15.12 v21.19,15.12
  Top 0.406: v8.99,26.8 8.61,27.18 YZ_BOARD.RATE_X
  Bottom 0.254: v21.19,15.12 20.17,15.12 19.66,15.62 19.66,19.31 19.92,19.56 19.92,21.59 18.9,22.61 13.18,22.61 11.15,24.64 9.5,24.64 9.25,24.9 9.25,26.55 v8.99,26.8
RATE_Z  (via drill 0.35)
  Top 0.254: 10.55,23.72 GYRO_Z.B1 10.14,23.31 10.14,23.24 | 10.55,23.72 GYRO_Z.A2 | v14.96,18.04 15.72,17.28 20.8,17.28 23.79,14.29 ADC1.P$9 | v9.25,24.01 10.26,24.01 10.55,23.72
  Bottom 0.254: C13.2 8.1,24.39 8.48,24.01 v9.25,24.01 10.9,24.01 14.96,19.94 v14.96,18.04
SCK
  Top 0.203: 17.25,5.59 17.25,6.1 19.15,8.01 20.8,8.01 23.92,11.12 ADC1.P$4 25.06,11.12 26.46,12.52 EEPROM.6 27.73,12.52 27.92,12.7 27.92,13.47 26.65,14.74 26.65,19.67 MAG.P$15 26.27,20.05 | X1.6 17.26,5.6
  Top 0.254: 17.26,5.6 17.25,5.59
  Top 0.61: X2.6 X1.6
ST1
  Top 0.254: 13.32,19.32 13.31,19.31 | GYRO_Z.G5 13.32,19.32 | GYRO_Z.F5 13.35,19.35 13.32,19.32
ST2
  Top 0.254: 12.55,19.31 GYRO_Z.G4 GYRO_Z.F4
TEMP
  Top 0.203: 18.58,15.56 ADC1.P$14
  Top 0.254: GYRO_Z.G3 GYRO_Z.F3 11.75,20.16 | GYRO_Z.G3 11.75,20.16 | 11.75,20.16 11.79,20.2 | GYRO_Z.G3 11.75,18.89 | 18.58,15.56 17.88,16.26 14.58,16.26 12.3,18.55 12.04,18.55 11.75,18.84 GYRO_Z.G3
V4096  (via drill 0.35)
  Top 0.203: C21.1 5.31,13.34 5.67,13.34
  Top 0.406: C21.1 5.31,13.21 5.49,13.03 6.77,13.03 REF4096.5 | 5.67,13.34 5.94,13.34 v6.96,14.35
  Bottom 0.305: 14.96,14.86 14.2,14.1 7.22,14.1 v6.96,14.35
  Bottom 0.406: v6.96,14.35 7.09,14.23 | 14.96,14.86 R9.1
VRATIO_OR_2V5  (via drill 0.35)
  Top 0.254: GYRO_Z.E2 GYRO_Z.E1 9.03,20.92 v8.87,21.09
  Bottom 0.254: v8.87,21.09 8.1,21.09 7.47,20.45 7.47,17.78 7.98,17.28 R10.2
VREF  (via drill 0.35)
  Top 0.203: 18.64,26.17 18.77,26.17 18.77,22.23 18.26,21.72 18.26,20.2 18.01,19.94 v16.23,19.94
  Top 0.254: U$2.P$14 23.11,23.48 23.09,23.5 23.11,23.52 U$2.P$15 24.16,23.57 C23.2 23.72,24.91 23.72,25.53 23.09,26.17 18.64,26.17 14.71,26.17 12.8,28.07 YZ_BOARD.VREF | XZ_BOARD.VREF 7.47,19.94 8.36,19.05 10.26,19.05 10.77,18.55 11.28,18.55 v12.42,17.4
  Top 0.305: ADC1.P$15 17.3,14.93 C2.1
  Top 0.406: 16.98,13.49 C2.1 | 16.98,13.49 17.65,13.49 v17.88,13.72 | 16.98,13.49 16.57,13.49 C16.1
  Bottom 0.254: v16.23,19.94 15.72,19.94 15.6,19.82 15.6,16.01
  Bottom 0.406: R10.1 12.3,17.28 v12.42,17.4 13.06,17.4 13.65,16.81 R8.2 15.6,16.01 16.61,16.01 16.7,15.92 R9.2 16.7,14.65 16.95,14.65 v17.88,13.72

### Text on the board
tDocu: Quadrotor IMU v1.02 | 2009/05
bDocu: Quadrotor IMU v1.02 | 2009/05 | Ay | r | Ax | Y | Z | X | GND | GND | +6V5 | MOSI | MISO | SCK | ADC_CS | MAG_CS | ADC_EOC | MAG_DRDY | MAG_RESET | EE_CS